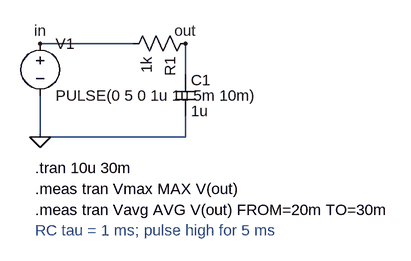
[diagram p0: schematic 02_tran_rc_pulse_meas.asc]
02_tran_rc_pulse_meas.asc, the LTspice schematic file:
Version 4
SHEET 1 880 680
WIRE 80 96 224 96
WIRE 304 96 304 144
WIRE 304 208 304 240
WIRE 80 176 80 240
WIRE 80 240 304 240
FLAG 80 240 0
FLAG 80 96 in
FLAG 304 96 out
SYMBOL voltage 80 80 R0
SYMATTR InstName V1
SYMATTR Value PULSE(0 5 0 1u 1u 5m 10m)
SYMBOL res 320 80 R90
SYMATTR InstName R1
SYMATTR Value 1k
SYMBOL cap 288 144 R0
SYMATTR InstName C1
SYMATTR Value 1u
TEXT 72 288 Left 2 !.tran 10u 30m
TEXT 72 320 Left 2 !.meas tran Vmax MAX V(out)
TEXT 72 352 Left 2 !.meas tran Vavg AVG V(out) FROM=20m TO=30m
TEXT 72 384 Left 2 ;RC tau = 1 ms; pulse high for 5 ms

The netlist it stands for:
* 02_tran_rc_pulse_meas.asc
V1 in 0 PULSE(0 5 0 1u 1u 5m 10m)
R1 out in 1k
C1 out 0 1u
.tran 10u 30m
.meas tran Vmax MAX V(out)
.meas tran Vavg AVG V(out) FROM=20m TO=30m
* RC tau = 1 ms; pulse high for 5 ms
.backanno
.end